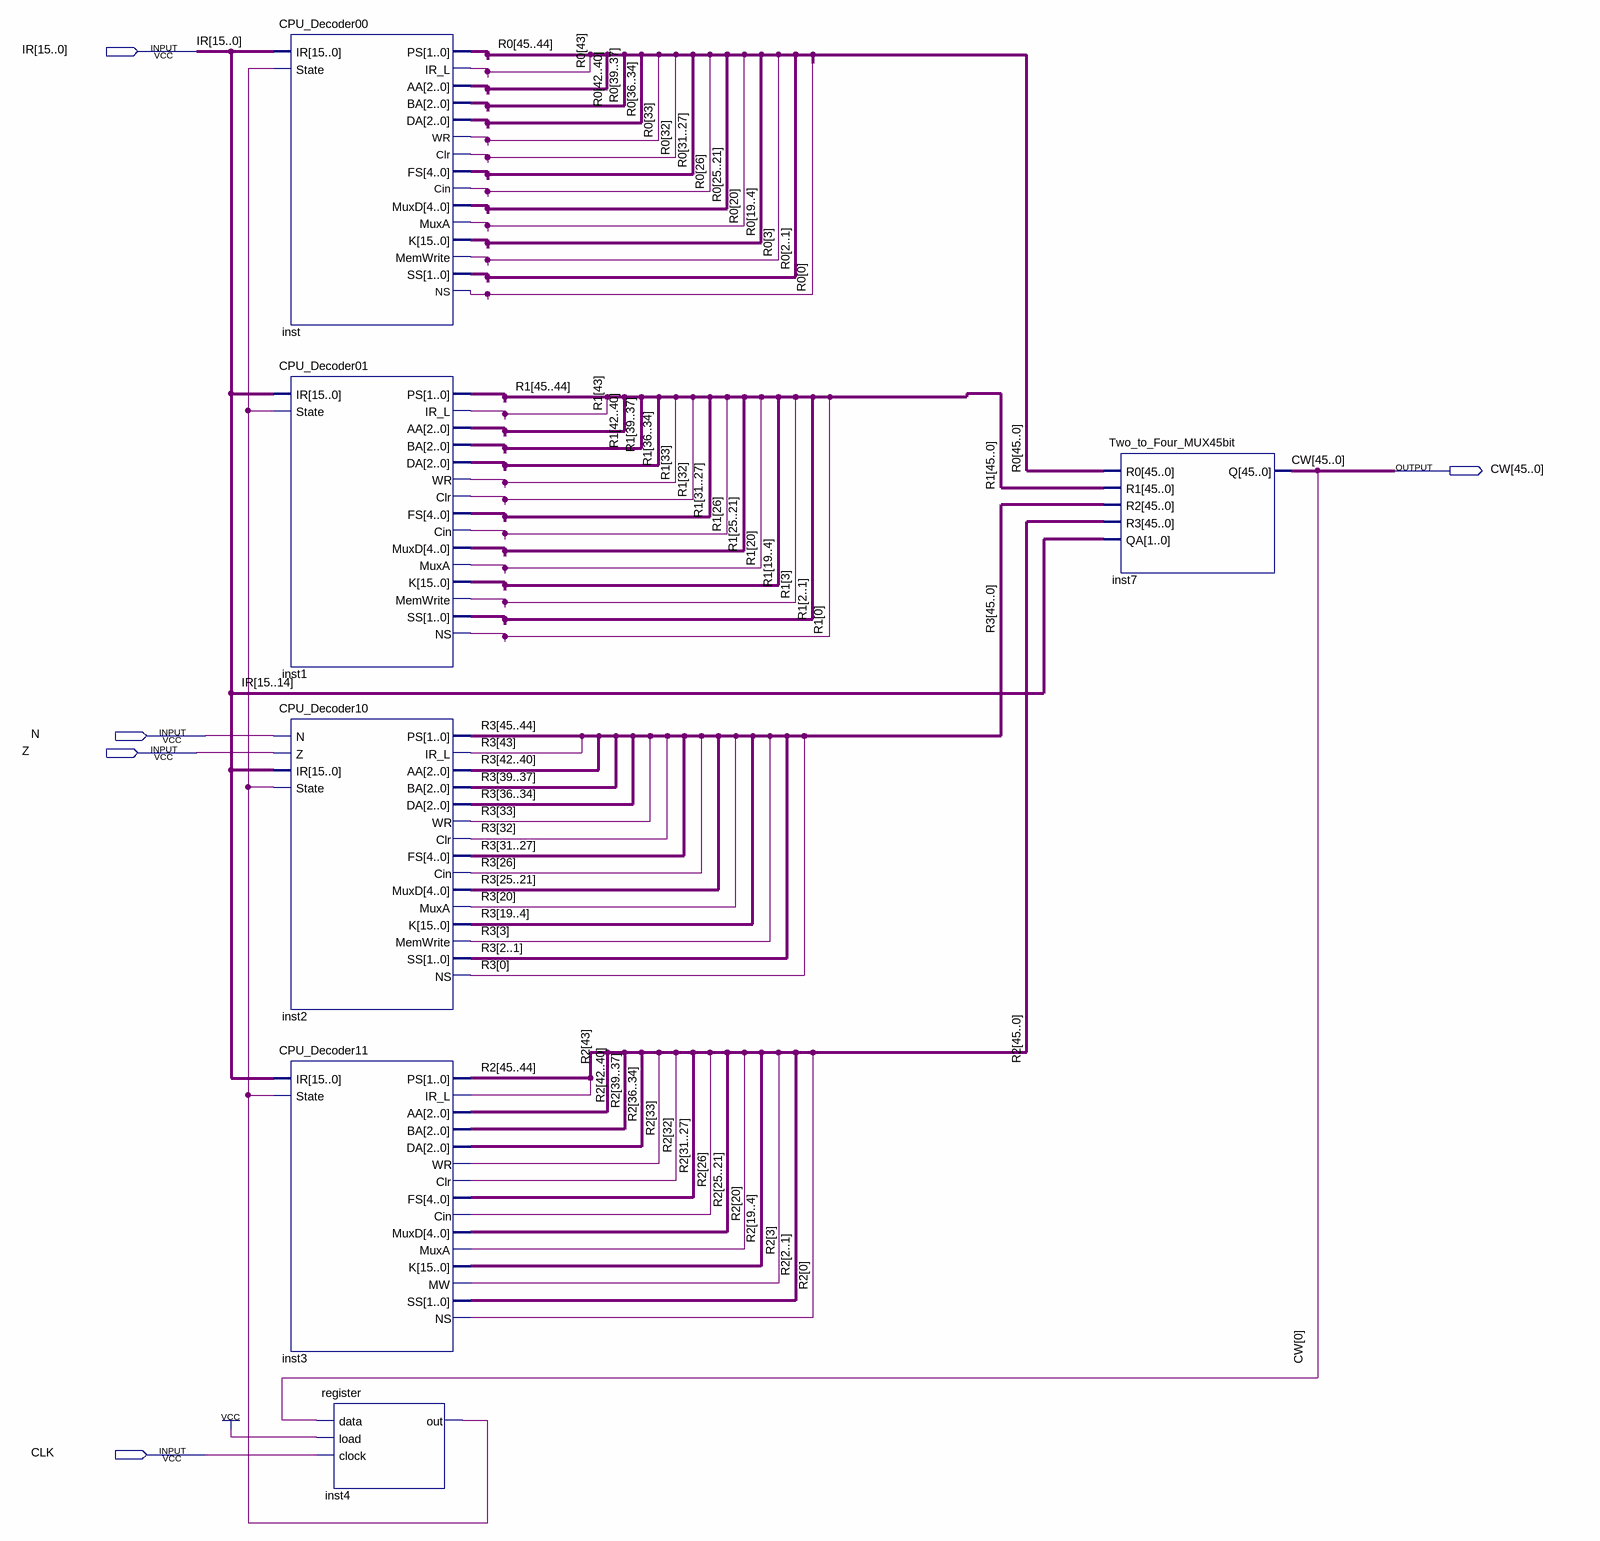
[diagram p0: schematic sheet]
// Quartus schematic ControlUnit.bdf as structural Verilog: 6 symbols, 5 pins
module ControlUnit (
  input  [15:0] IR,
  input  N,
  input  Z,
  input  CLK,
  output [45:0] CW
);

  wire inst4_out;
  wire [45:0] R0, R1, R2, R3;

  CPU_Decoder00 inst (
    .IR(IR), .State(inst4_out), .PS(R0[45:44]), .IR_L(R0[43]), .AA(R0[42:40]), .BA(R0[39:37]),
    .DA(R0[36:34]), .WR(R0[33]), .Clr(R0[32]), .FS(R0[31:27]), .Cin(R0[26]), .MuxD(R0[25:21]), .MuxA(R0[20]),
    .K(R0[19:4]), .MemWrite(R0[3]), .SS(R0[2:1]), .NS(R0[0]));
  CPU_Decoder01 inst1 (
    .IR(IR), .State(inst4_out), .PS(R1[45:44]), .IR_L(R1[43]), .AA(R1[42:40]), .BA(R1[39:37]),
    .DA(R1[36:34]), .WR(R1[33]), .Clr(R1[32]), .FS(R1[31:27]), .Cin(R1[26]), .MuxD(R1[25:21]), .MuxA(R1[20]),
    .K(R1[19:4]), .MemWrite(R1[3]), .SS(R1[2:1]), .NS(R1[0]));
  CPU_Decoder10 inst2 (
    .N(N), .Z(Z), .IR(IR), .State(inst4_out), .PS(R3[45:44]), .IR_L(R3[43]), .AA(R3[42:40]), .BA(R3[39:37]),
    .DA(R3[36:34]), .WR(R3[33]), .Clr(R3[32]), .FS(R3[31:27]), .Cin(R3[26]), .MuxD(R3[25:21]), .MuxA(R3[20]),
    .K(R3[19:4]), .MemWrite(R3[3]), .SS(R3[2:1]), .NS(R3[0]));
  CPU_Decoder11 inst3 (
    .IR(IR), .State(inst4_out), .PS(R2[45:44]), .IR_L(R2[43]), .AA(R2[42:40]), .BA(R2[39:37]),
    .DA(R2[36:34]), .WR(R2[33]), .Clr(R2[32]), .FS(R2[31:27]), .Cin(R2[26]), .MuxD(R2[25:21]), .MuxA(R2[20]),
    .K(R2[19:4]), .MW(R2[3]), .SS(R2[2:1]), .NS(R2[0]));
  register inst4 (.data(CW[0]), .load(1'b1), .clock(CLK), .out(inst4_out));
  Two_to_Four_MUX45bit inst7 (.R0(R0), .R1(R1), .R2(R3), .R3(R2), .QA(IR[15:14]), .Q(CW));
endmodule
